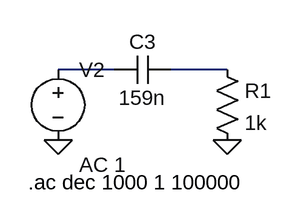
[diagram p0: schematic HPFDesign_402101577.asc]
HPFDesign_402101577.asc, the LTspice schematic file:
Version 4
SHEET 1 880 680
WIRE 208 144 144 144
WIRE 336 144 272 144
FLAG 336 224 0
FLAG 144 224 0
SYMBOL cap 272 128 R90
WINDOW 0 0 32 VBottom 2
WINDOW 3 32 32 VTop 2
SYMATTR InstName C3
SYMATTR Value 159n
SYMBOL res 320 128 R0
SYMATTR InstName R1
SYMATTR Value 1k
SYMBOL voltage 144 128 R0
WINDOW 123 24 124 Left 2
WINDOW 39 0 0 Left 0
SYMATTR InstName V2
SYMATTR Value ""
SYMATTR Value2 AC 1
TEXT 110 272 Left 2 !.ac dec 1000 1 100000

The netlist it stands for:
* HPFDesign_402101577.asc
C3 N002 N001 159n
R1 N002 0 1k
V2 N001 0 AC 1
.ac dec 1000 1 100000
.backanno
.end